# Altium project multiplexer_board.PrjPcb
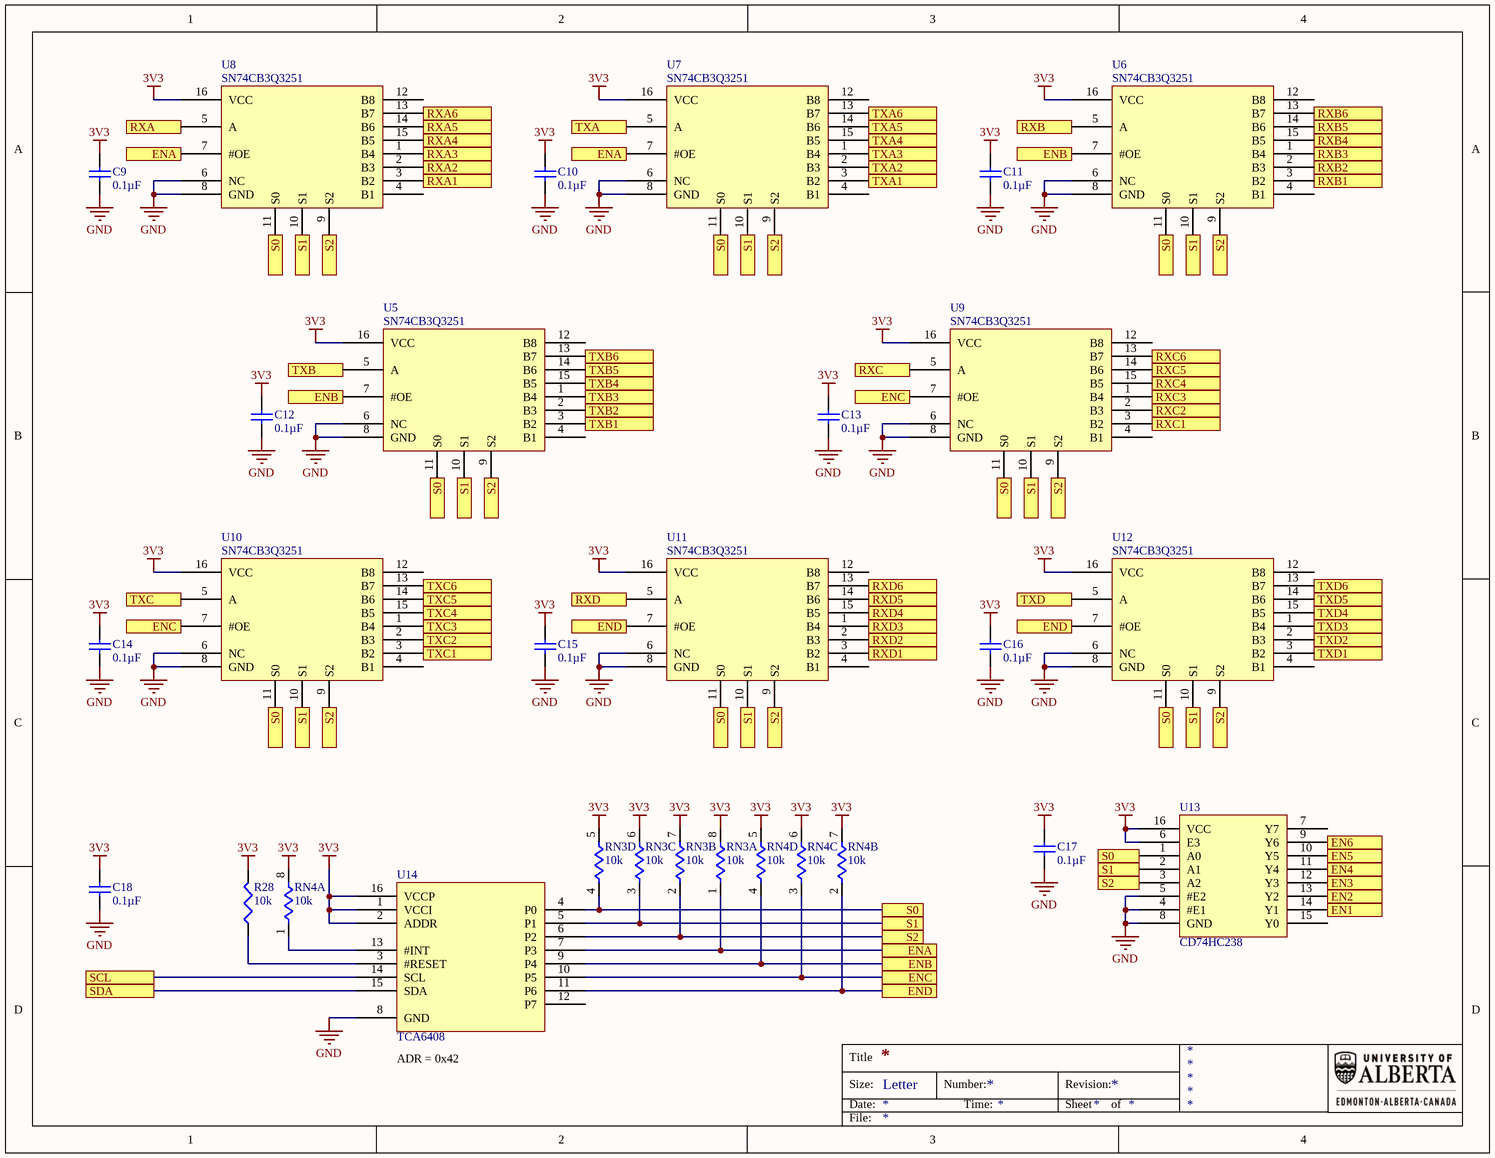
[diagram p0: multiplexers.SchDoc]
5 sheets, 113 parts. Net scope: flat (ports and power ports of the same name join across sheets).
Board file: multiplexer_board.PcbDoc
Sheets:
  multiplexers.SchDoc
  Connectors.SchDoc
  Slip_Ring.SchDoc
  Current_Sensors.SchDoc
  PWM_Controller.SchDoc

## Sheet multiplexers.SchDoc
size Letter

### Parts
C9  value 0.1µF  [TDK-CGA3E]  (hidden comment: Cap)
C10  value 0.1µF  [TDK-CGA3E]  (hidden comment: Cap)
C11  value 0.1µF  [TDK-CGA3E]  (hidden comment: Cap)
C12  value 0.1µF  [TDK-CGA3E]  (hidden comment: Cap)
C13  value 0.1µF  [TDK-CGA3E]  (hidden comment: Cap)
C14  value 0.1µF  [TDK-CGA3E]  (hidden comment: Cap)
C15  value 0.1µF  [TDK-CGA3E]  (hidden comment: Cap)
C16  value 0.1µF  [TDK-CGA3E]  (hidden comment: Cap)
C17  value 0.1µF  [TDK-CGA3E]  (hidden comment: Cap)
C18  value 0.1µF  [TDK-CGA3E]  (hidden comment: Cap)
R28  value 10k  [PANA-ERJ3EK]  (hidden comment: Res3)
RN3  value 10k  [PANA-EXB1206]  (hidden comment: Res4 Pack1)  (parts A,B,C,D of 4)
RN4  value 10k  [PANA-EXB1206]  (hidden comment: Res4 Pack1)  (parts A,B,C,D of 4)
U5  SN74CB3Q3251  [TI-PW]
U6  SN74CB3Q3251  [TI-PW]
U7  SN74CB3Q3251  [TI-PW]
U8  SN74CB3Q3251  [TI-PW]
U9  SN74CB3Q3251  [TI-PW]
U10  SN74CB3Q3251  [TI-PW]
U11  SN74CB3Q3251  [TI-PW]
U12  SN74CB3Q3251  [TI-PW]
U13  CD74HC238  [TI-PW]
U14  TCA6408  [TI-PW]

### Ports
EN1, EN2, EN3, EN4, EN5, EN6, ENA, ENB, ENC, END, RXA, RXA1, RXA2, RXA3, RXA4, RXA5, RXA6, RXB, RXB1, RXB2, RXB3, RXB4, RXB5, RXB6, RXC, RXC1, RXC2, RXC3, RXC4, RXC5, RXC6, RXD, RXD1, RXD2, RXD3, RXD4, RXD5, RXD6, S0, S1, S2, SCL, SDA, TXA, TXA1, TXA2, TXA3, TXA4, TXA5, TXA6, TXB, TXB1, TXB2, TXB3, TXB4, TXB5, TXB6, TXC, TXC1, TXC2, TXC3, TXC4, TXC5, TXC6, TXD, TXD1, TXD2, TXD3, TXD4, TXD5, TXD6

### Nets
3V3: C9.2 C10.2 C11.2 C12.2 C13.2 C14.2 C15.2 C16.2 C17.2 C18.2 R28.2 RN3.5 RN3.6 RN3.7 RN3.8 RN4.5 RN4.6 RN4.7 RN4.8 U5.16(VCC) U6.16(VCC) U7.16(VCC) U8.16(VCC) U9.16(VCC) U10.16(VCC) U11.16(VCC) U12.16(VCC) U13.6(E3) U13.16(VCC) U14.1(VCCI) U14.2(ADDR) U14.16(VCCP)
GND: C9.1 C10.1 C11.1 C12.1 C13.1 C14.1 C15.1 C16.1 C17.1 C18.1 U5.6(NC) U5.8(GND) U6.6(NC) U6.8(GND) U7.6(NC) U7.8(GND) U8.6(NC) U8.8(GND) U9.6(NC) U9.8(GND) U10.6(NC) U10.8(GND) U11.6(NC) U11.8(GND) U12.6(NC) U12.8(GND) U13.4(#E1) U13.5(#E2) U13.8(GND) U14.8(GND)
NetP1_1: U8.3(B2) ; port RXA1
NetP1_2: U7.3(B2) ; port TXA1
NetP1_5: U6.3(B2) ; port RXB1
NetP1_6: U5.3(B2) ; port TXB1
NetP1_15: U10.3(B2) ; port TXC1
NetP1_16: U9.3(B2) ; port RXC1
NetP1_19: U12.3(B2) ; port TXD1
NetP1_20: U11.3(B2) ; port RXD1
NetP2_1: U8.15(B5) ; port RXA4
NetP2_2: U7.15(B5) ; port TXA4
NetP2_5: U6.15(B5) ; port RXB4
NetP2_6: U5.15(B5) ; port TXB4
NetP2_15: U10.15(B5) ; port TXC4
NetP2_16: U9.15(B5) ; port RXC4
NetP2_19: U12.15(B5) ; port TXD4
NetP2_20: U11.15(B5) ; port RXD4
NetP3_1: U8.2(B3) ; port RXA2
NetP3_2: U7.2(B3) ; port TXA2
NetP3_5: U6.2(B3) ; port RXB2
NetP3_6: U5.2(B3) ; port TXB2
NetP3_15: U10.2(B3) ; port TXC2
NetP3_16: U9.2(B3) ; port RXC2
NetP3_19: U12.2(B3) ; port TXD2
NetP3_20: U11.2(B3) ; port RXD2
NetP4_1: U8.14(B6) ; port RXA5
NetP4_2: U7.14(B6) ; port TXA5
NetP4_5: U6.14(B6) ; port RXB5
NetP4_6: U5.14(B6) ; port TXB5
NetP4_15: U10.14(B6) ; port TXC5
NetP4_16: U9.14(B6) ; port RXC5
NetP4_19: U12.14(B6) ; port TXD5
NetP4_20: U11.14(B6) ; port RXD5
NetP5_1: U8.1(B4) ; port RXA3
NetP5_2: U7.1(B4) ; port TXA3
NetP5_5: U6.1(B4) ; port RXB3
NetP5_6: U5.1(B4) ; port TXB3
NetP5_15: U10.1(B4) ; port TXC3
NetP5_16: U9.1(B4) ; port RXC3
NetP5_19: U12.1(B4) ; port TXD3
NetP5_20: U11.1(B4) ; port RXD3
NetP6_1: U8.13(B7) ; port RXA6
NetP6_2: U7.13(B7) ; port TXA6
NetP6_5: U6.13(B7) ; port RXB6
NetP6_6: U5.13(B7) ; port TXB6
NetP6_15: U10.13(B7) ; port TXC6
NetP6_16: U9.13(B7) ; port RXC6
NetP6_19: U12.13(B7) ; port TXD6
NetP6_20: U11.13(B7) ; port RXD6
NetP7_1: U8.5(A) ; port RXA
NetP7_2: U7.5(A) ; port TXA
NetP7_3: U6.5(A) ; port RXB
NetP7_4: U5.5(A) ; port TXB
NetP8_1: U9.5(A) ; port RXC
NetP8_2: U10.5(A) ; port TXC
NetP8_3: U11.5(A) ; port RXD
NetP8_4: U12.5(A) ; port TXD
NetP9_3: U14.14(SCL) ; port SCL
NetP9_4: U14.15(SDA) ; port SDA
NetQ1_2: U13.14(Y1) ; port EN1
NetQ2_2: U13.11(Y4) ; port EN4
NetQ3_2: U13.13(Y2) ; port EN2
NetQ4_2: RN3.1 U7.7(#OE) U8.7(#OE) U14.7(P3) ; port ENA
NetQ5_2: RN4.4 U5.7(#OE) U6.7(#OE) U14.9(P4) ; port ENB
NetQ6_2: RN4.3 U9.7(#OE) U10.7(#OE) U14.10(P5) ; port ENC
NetQ7_2: RN4.2 U11.7(#OE) U12.7(#OE) U14.11(P6) ; port END
NetQ8_2: U13.10(Y5) ; port EN5
NetQ9_2: U13.12(Y3) ; port EN3
NetQ10_2: U13.9(Y6) ; port EN6
NetR28_1: R28.1 U14.3(#RESET)
NetRN3_2: RN3.2 U5.9(S2) U6.9(S2) U7.9(S2) U8.9(S2) U9.9(S2) U10.9(S2) U11.9(S2) U12.9(S2) U13.3(A2) U14.6(P2) ; port S2
NetRN3_3: RN3.3 U5.10(S1) U6.10(S1) U7.10(S1) U8.10(S1) U9.10(S1) U10.10(S1) U11.10(S1) U12.10(S1) U13.2(A1) U14.5(P1) ; port S1
NetRN3_4: RN3.4 U5.11(S0) U6.11(S0) U7.11(S0) U8.11(S0) U9.11(S0) U10.11(S0) U11.11(S0) U12.11(S0) U13.1(A0) U14.4(P0) ; port S0
NetRN4_1: RN4.1 U14.13(#INT)

Not connected (* = marked no-connect by the designer): U5 4(B1) 12(B8); U6 4(B1) 12(B8); U7 4(B1) 12(B8); U8 4(B1) 12(B8); U9 4(B1) 12(B8); U10 4(B1) 12(B8); U11 4(B1) 12(B8); U12 4(B1) 12(B8); U13 7(Y7) 15(Y0); U14 12(P7)

### Notes on the sheet
- (near U14) ADR = 0x42
- Title
- Size:
- Date:
- Letter
- Number:
- Time:
- Revision:
- Sheet
- of
- File:

### Library data of the parts
C9-C18 = PC-TDK-02273: CAP CER 0.1UF 50V X8R 0603; Manufacturer Part Number: CGA3E3X8R1H104M080AB; Index: 2273; Designator: C?; Tolerance: ±20%; Published: 3/16/2016; LatestRevisionDate: 3/16/2016; LatestRevisionNote: ...; PackageReference: 0603 (1608 Metric); Publisher: AlbertaSat; PackageDescription: Radial Cap, Thru-Hole; 2 Leads; 0.3 in Pin Spacing; Part Number: PC-TDK-02273; Supplier Part Number 1: 445-12607-1-ND; Supplier 1: Digi-key; Supplier Link: http://www.digikey.ca/product-search/en?keywords=445-12607-1-ND; Voltage - Rated: 50V; Temperature Coefficient: X8R; Applications: Automotive
R28 = 17203: RES SMD 10K OHM 1% 1/10W 0603; Part Number: 17203; Manufacturer Part Number: ERJ-3EKF1002V; Designator: R?; Power: 0.1W, 1/10W; Temperature Coefficient: ±100ppm/°C; Published: 8-Jun-2000; LatestRevisionDate: 29-May-2009; LatestRevisionNote: IPC-7351 Footprint Added.; PackageReference: 0603 (1608 Metric); Publisher: Altium Limited; PackageDescription: Chip Resistor, 2-Leads, Body 1.60x0.80mm, IPC Low Density; Supplier Part Number 1: P10.0KHCT-ND; Supplier 1: Digi-Key; Supplier Link: http://www.digikey.ca/product-search/en?keywords=P10.0KHCT-ND; Tolerance: ±1%
RN3 RN4 = 19842: RES ARRAY 4 RES 10K OHM 1206; Part Number: 19842; Manufacturer Part Number: EXB-38V103JV; Sim Note: Enter the Resistance value into parameter field.; Designator: RN?; Tolerance: ±5%; Power: 62.5mW; Temperature Coefficient: ±200ppm/°C; Code_JEDEC: MS-012-AC; Supplier Part Number 1: Y9103CT-ND; Supplier 1: Digi-Key; Supplier Link: http://www.digikey.ca/product-search/en?keywords=Y9103CT-ND; PackageReference: 1206 (3216 Metric), Convex, Long Side Terminals; PackageDescription: Chip Array, ConvexS, 8-Leads, Pitch 0.80mm,  Body 3.20x1.60mm,  IPC Low Density
U5-U12 = 42: IC HI-BAND MUX/DEMUX 16-TSSOP; Part Number: 42; Manufacturer Part Number: SN74CB3Q3251PWR; Designator: U?; Supplier Part Number 2: 595-SN74CB3Q3251PWR; Supplier 2: Mouser; Supplier Part Number 1: 296-18204-1-ND; Supplier 1: Digi-Key; Supplier Link: #https://www.digikey.ca/product-detail/en/texas-instruments/SN74CB3Q3251PWR/296-18204-1-ND/773829#; PackageReference: TI-TSSOP16
U13 = 45: IC DECODER/DEMUX HS 3-8 16TSSOP; Part Number: 45; Manufacturer Part Number: CD74HC238PW; Designator: U?; Supplier Part Number 2: 595-CD74HC238PWR; Supplier 2: Mouser; Supplier Part Number 1: 296-33050-5-ND; Supplier 1: Digi-Key; Supplier Link: #https://www.digikey.ca/product-detail/en/texas-instruments/CD74HC238PW/296-33050-5-ND/1506874#; PackageReference: TI-16TSSOP
U14 = 46: IC I/O EXPANDER I2C 8B 16TSSOP; Part Number: 46; Manufacturer Part Number: TCA6408AQPWRQ1; Designator: U?; Supplier Part Number 2: 595-TCA6408AQPWRQ1; Supplier 2: Mouser; Supplier Part Number 1: 296-44902-1-ND; Supplier 1: Digi-Key; Supplier Link: #https://www.digikey.com/products/en/integrated-circuits-ics/interface-i-o-expanders/749?k=&pkeyword=&s=39106&FV=1c0002%2C1c0006%2C4032eb%2C403305%2C40346d%2C4035f0%2C1140003%2C26800c4%2C2680042%2C2680043%2C274001d%2C2740253%2C1f140000%2Cffe002ed%2Cfffc0128&quantity=0&ColumnSort=0&page=1&stock=1&pageSize=250#; PackageReference: TI-16TSSOP

## Sheet Connectors.SchDoc
size Letter
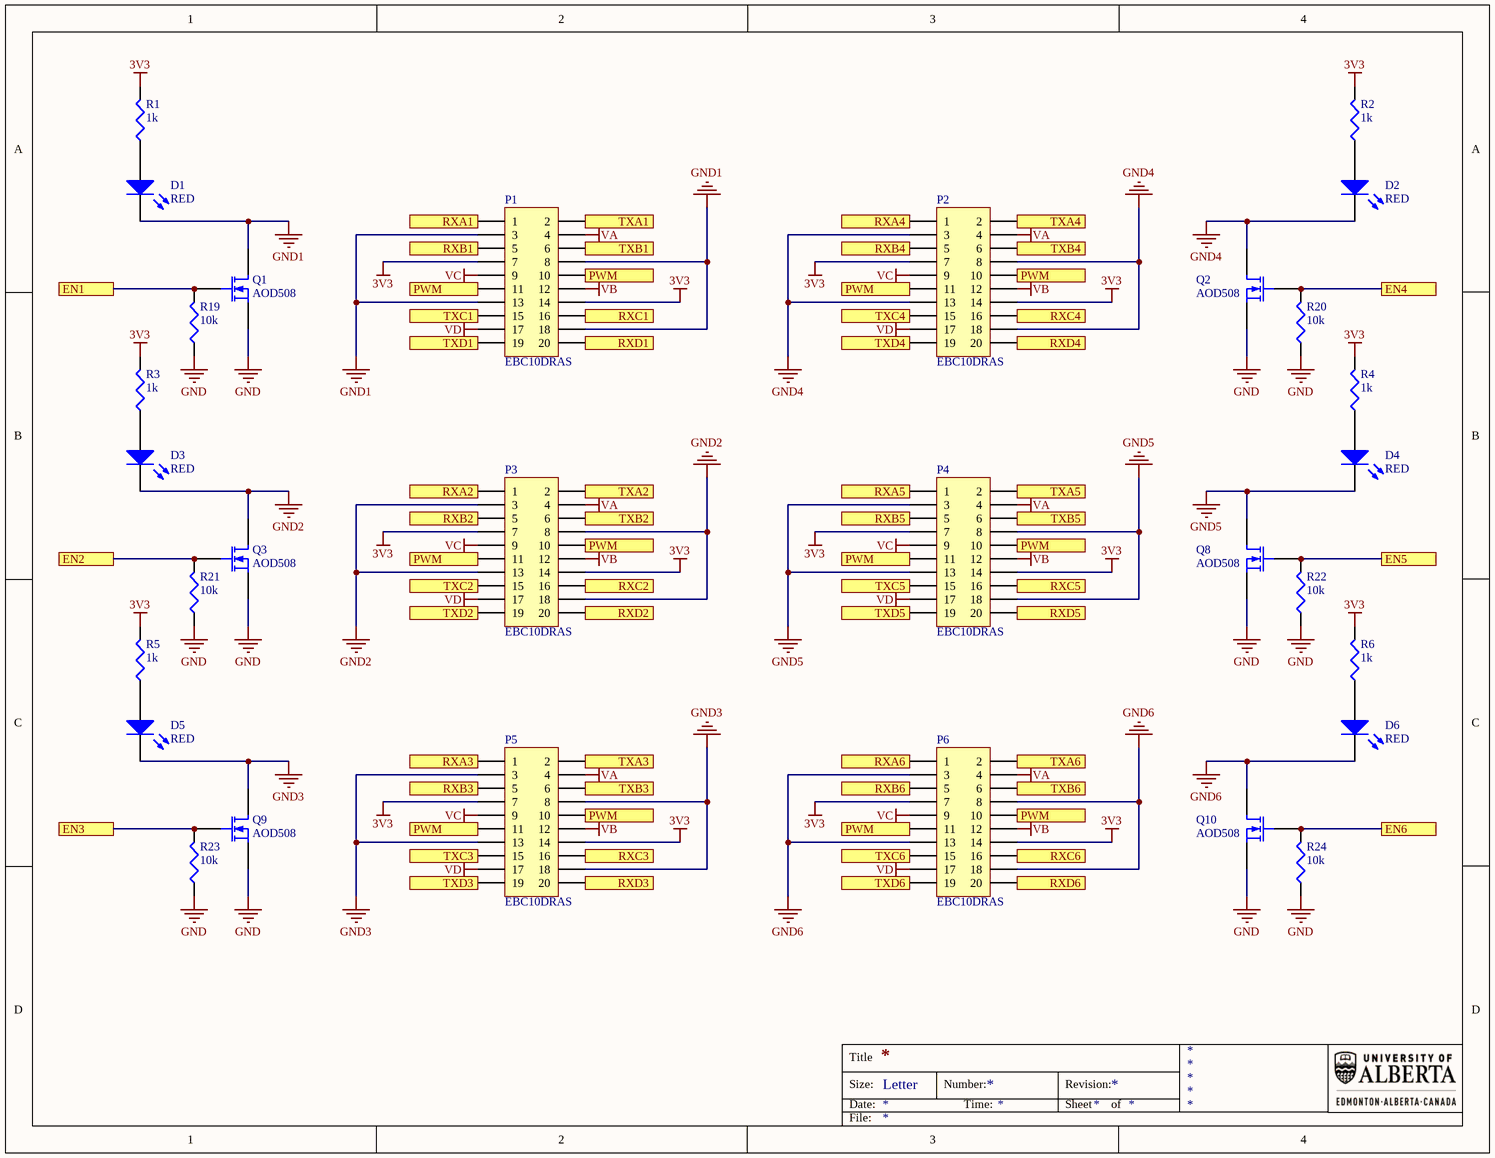
[diagram p1: Connectors.SchDoc]

### Parts
D1  value RED  [WL-150060XS75000]  (hidden comment: LED)
D2  value RED  [WL-150060XS75000]  (hidden comment: LED)
D3  value RED  [WL-150060XS75000]  (hidden comment: LED)
D4  value RED  [WL-150060XS75000]  (hidden comment: LED)
D5  value RED  [WL-150060XS75000]  (hidden comment: LED)
D6  value RED  [WL-150060XS75000]  (hidden comment: LED)
P1  Manufacturer Part Number: EBC10DRAS  [SLN-EBC10DRAS]  (hidden comment: Header 10x2)
P2  Manufacturer Part Number: EBC10DRAS  [SLN-EBC10DRAS]  (hidden comment: Header 10x2)
P3  Manufacturer Part Number: EBC10DRAS  [SLN-EBC10DRAS]  (hidden comment: Header 10x2)
P4  Manufacturer Part Number: EBC10DRAS  [SLN-EBC10DRAS]  (hidden comment: Header 10x2)
P5  Manufacturer Part Number: EBC10DRAS  [SLN-EBC10DRAS]  (hidden comment: Header 10x2)
P6  Manufacturer Part Number: EBC10DRAS  [SLN-EBC10DRAS]  (hidden comment: Header 10x2)
Q1  AOD508  [AO-TO252]
Q2  AOD508  [AO-TO252]
Q3  AOD508  [AO-TO252]
Q8  AOD508  [AO-TO252]
Q9  AOD508  [AO-TO252]
Q10  AOD508  [AO-TO252]
R1  value 1k  [PANA-ERJ3EK]  (hidden comment: Res3)
R2  value 1k  [PANA-ERJ3EK]  (hidden comment: Res3)
R3  value 1k  [PANA-ERJ3EK]  (hidden comment: Res3)
R4  value 1k  [PANA-ERJ3EK]  (hidden comment: Res3)
R5  value 1k  [PANA-ERJ3EK]  (hidden comment: Res3)
R6  value 1k  [PANA-ERJ3EK]  (hidden comment: Res3)
R19  value 10k  [PANA-ERJ3EK]  (hidden comment: Res3)
R20  value 10k  [PANA-ERJ3EK]  (hidden comment: Res3)
R21  value 10k  [PANA-ERJ3EK]  (hidden comment: Res3)
R22  value 10k  [PANA-ERJ3EK]  (hidden comment: Res3)
R23  value 10k  [PANA-ERJ3EK]  (hidden comment: Res3)
R24  value 10k  [PANA-ERJ3EK]  (hidden comment: Res3)

### Ports
EN1, EN2, EN3, EN4, EN5, EN6, PWM, RXA1, RXA2, RXA3, RXA4, RXA5, RXA6, RXB1, RXB2, RXB3, RXB4, RXB5, RXB6, RXC1, RXC2, RXC3, RXC4, RXC5, RXC6, RXD1, RXD2, RXD3, RXD4, RXD5, RXD6, TXA1, TXA2, TXA3, TXA4, TXA5, TXA6, TXB1, TXB2, TXB3, TXB4, TXB5, TXB6, TXC1, TXC2, TXC3, TXC4, TXC5, TXC6, TXD1, TXD2, TXD3, TXD4, TXD5, TXD6

### Nets
3V3: P1.7 P1.14 P2.7 P2.14 P3.7 P3.14 P4.7 P4.14 P5.7 P5.14 P6.7 P6.14 R1.2 R2.2 R3.2 R4.2 R5.2 R6.2
GND: Q1.3(S) Q2.3(S) Q3.3(S) Q8.3(S) Q9.3(S) Q10.3(S) R19.1 R20.1 R21.1 R22.1 R23.1 R24.1
GND1: D1.2(K) P1.3 P1.8 P1.13 P1.18 Q1.1(D)
GND2: D3.2(K) P3.3 P3.8 P3.13 P3.18 Q3.1(D)
GND3: D5.2(K) P5.3 P5.8 P5.13 P5.18 Q9.1(D)
GND4: D2.2(K) P2.3 P2.8 P2.13 P2.18 Q2.1(D)
GND5: D4.2(K) P4.3 P4.8 P4.13 P4.18 Q8.1(D)
GND6: D6.2(K) P6.3 P6.8 P6.13 P6.18 Q10.1(D)
VA: P1.4 P2.4 P3.4 P4.4 P5.4 P6.4
VB: P1.12 P2.12 P3.12 P4.12 P5.12 P6.12
VC: P1.9 P2.9 P3.9 P4.9 P5.9 P6.9
VD: P1.17 P2.17 P3.17 P4.17 P5.17 P6.17
NetD1_1: D1.1(A) R1.1
NetD2_1: D2.1(A) R2.1
NetD3_1: D3.1(A) R3.1
NetD4_1: D4.1(A) R4.1
NetD5_1: D5.1(A) R5.1
NetD6_1: D6.1(A) R6.1
NetP1_1: P1.1 ; port RXA1
NetP1_2: P1.2 ; port TXA1
NetP1_5: P1.5 ; port RXB1
NetP1_6: P1.6 ; port TXB1
NetP1_10: P1.10 P1.11 P2.10 P2.11 P3.10 P3.11 P4.10 P4.11 P5.10 P5.11 P6.10 P6.11 ; port PWM
NetP1_15: P1.15 ; port TXC1
NetP1_16: P1.16 ; port RXC1
NetP1_19: P1.19 ; port TXD1
NetP1_20: P1.20 ; port RXD1
NetP2_1: P2.1 ; port RXA4
NetP2_2: P2.2 ; port TXA4
NetP2_5: P2.5 ; port RXB4
NetP2_6: P2.6 ; port TXB4
NetP2_15: P2.15 ; port TXC4
NetP2_16: P2.16 ; port RXC4
NetP2_19: P2.19 ; port TXD4
NetP2_20: P2.20 ; port RXD4
NetP3_1: P3.1 ; port RXA2
NetP3_2: P3.2 ; port TXA2
NetP3_5: P3.5 ; port RXB2
NetP3_6: P3.6 ; port TXB2
NetP3_15: P3.15 ; port TXC2
NetP3_16: P3.16 ; port RXC2
NetP3_19: P3.19 ; port TXD2
NetP3_20: P3.20 ; port RXD2
NetP4_1: P4.1 ; port RXA5
NetP4_2: P4.2 ; port TXA5
NetP4_5: P4.5 ; port RXB5
NetP4_6: P4.6 ; port TXB5
NetP4_15: P4.15 ; port TXC5
NetP4_16: P4.16 ; port RXC5
NetP4_19: P4.19 ; port TXD5
NetP4_20: P4.20 ; port RXD5
NetP5_1: P5.1 ; port RXA3
NetP5_2: P5.2 ; port TXA3
NetP5_5: P5.5 ; port RXB3
NetP5_6: P5.6 ; port TXB3
NetP5_15: P5.15 ; port TXC3
NetP5_16: P5.16 ; port RXC3
NetP5_19: P5.19 ; port TXD3
NetP5_20: P5.20 ; port RXD3
NetP6_1: P6.1 ; port RXA6
NetP6_2: P6.2 ; port TXA6
NetP6_5: P6.5 ; port RXB6
NetP6_6: P6.6 ; port TXB6
NetP6_15: P6.15 ; port TXC6
NetP6_16: P6.16 ; port RXC6
NetP6_19: P6.19 ; port TXD6
NetP6_20: P6.20 ; port RXD6
NetQ1_2: Q1.2(G) R19.2 ; port EN1
NetQ2_2: Q2.2(G) R20.2 ; port EN4
NetQ3_2: Q3.2(G) R21.2 ; port EN2
NetQ8_2: Q8.2(G) R22.2 ; port EN5
NetQ9_2: Q9.2(G) R23.2 ; port EN3
NetQ10_2: Q10.2(G) R24.2 ; port EN6

### Notes on the sheet
- Title
- Size:
- Date:
- Letter
- Number:
- Time:
- Revision:
- Sheet
- of
- File:

### Library data of the parts
D1-D6 = 3: LED RED CLEAR 0603 SMD; Part Number: 3; Manufacturer Part Number: 150060RS75000; Designator: D?; Brightness: 250mcd; Published: 8-Jun-2000; LatestRevisionDate: 08-Jul-2005; LatestRevisionNote: Mech Layer 1 removed.; PackageReference: WL-150060XS75000; Publisher: Altium Limited; PackageDescription: LED; 2 Leads; Supplier Part Number 1: 732-4978-1-ND; Supplier 1: Digi-Key; Supplier Link: http://www.digikey.ca/product-search/en?keywords=732-4978-1-ND
P1-P6 = PP-SLN-00105: CONN EDGE DUAL FMALE 20POS 0.100; Index: 105; Designator: P?; Number of Positions: 20; Pitch: 0.100" (2.54mm); LatestRevisionDate: 3/22/2018; LatestRevisionNote: ...; Publisher: AlbertaSat; Part Number: PP-SLN-00105; Supplier Part Number 1: S3300-ND; Supplier 1: Digi-key; Published: 3/22/2018; PackageReference: SLN-EBC10DRAS; PackageDescription: CONN EDGE DUAL FMALE 20POS 0.100; Supplier Link: #https://www.digikey.ca/product-detail/en/sullins-connector-solutions/EBC10DRAS/S3300-ND/927252#; Number of Rows: 2; Mounting Type: Through Hole
Q1-Q3 Q8-Q10 = 1: MOSFET N-CH 30V 22A TO252; Part Number: 1; Designator: Q?; Published: 8-Jun-2000; LatestRevisionDate: 17-Jul-2002; LatestRevisionNote: Re-released for DXP Platform.; PackageVersion: 1995/1996; PackageReference: AO-TO252; Publisher: Altium Limited; PackageDescription: TO, Flat Index; 3 In-Line, Axial Leads; Body Dia. 4.6mm; Lead Dia. 0.5 mm (max); Manufacturer Part Number: AOD508; Supplier Part Number 1: 785-1355-1-ND; Supplier 1: Digi-Key; Supplier Link: #http://www.digikey.ca/product-search/en?keywords=785-1355-1-ND#
R1-R6 = 15398: RES SMD 1K OHM 1% 1/10W 0603; Part Number: 15398; Manufacturer Part Number: ERJ-3EKF1001V; Designator: R?; Power: 0.1W, 1/10W; Temperature Coefficient: ±100ppm/°C; Published: 8-Jun-2000; LatestRevisionDate: 29-May-2009; LatestRevisionNote: IPC-7351 Footprint Added.; PackageReference: 0603 (1608 Metric); Publisher: Altium Limited; PackageDescription: Chip Resistor, 2-Leads, Body 1.60x0.80mm, IPC Low Density; Supplier Part Number 1: P1.00KHCT-ND; Supplier 1: Digi-Key; Supplier Link: http://www.digikey.ca/product-search/en?keywords=P1.00KHCT-ND; Tolerance: ±1%
R19-R24 = 17203: as R28 on sheet multiplexers; Published: 8-Jun-2000; LatestRevisionDate: 29-May-2009; LatestRevisionNote: IPC-7351 Footprint Added.; PackageReference: 0603 (1608 Metric); Publisher: Altium Limited; PackageDescription: Chip Resistor, 2-Leads, Body 1.60x0.80mm, IPC Low Density; Supplier Part Number 1: P10.0KHCT-ND; Supplier 1: Digi-Key; Supplier Link: http://www.digikey.ca/product-search/en?keywords=P10.0KHCT-ND; Tolerance: ±1%

## Sheet Slip_Ring.SchDoc
size Letter
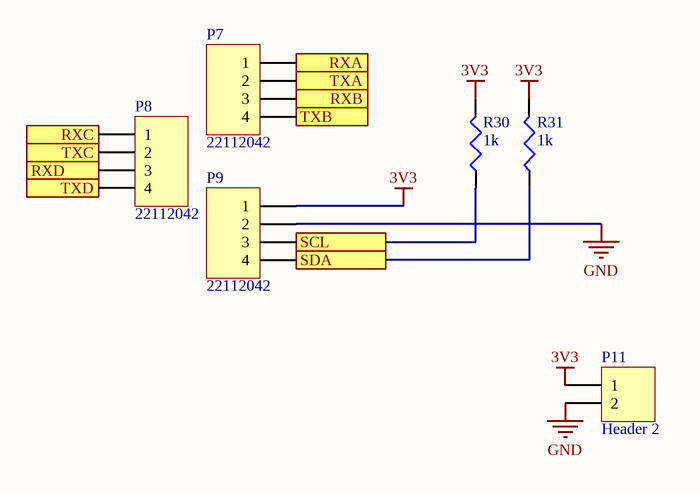
[diagram p2: Slip_Ring.SchDoc]

### Parts
P7  Manufacturer Part Number: 22112042  [MOLX-22112042]  (hidden comment: Header 4)
P8  Manufacturer Part Number: 22112042  [MOLX-22112042]  (hidden comment: Header 4)
P9  Manufacturer Part Number: 22112042  [MOLX-22112042]  (hidden comment: Header 4)
P11  Header 2  [MOLX-0010845020]
R30  value 1k  [PANA-ERJ3EK]  (hidden comment: Res3)
R31  value 1k  [PANA-ERJ3EK]  (hidden comment: Res3)

### Ports
RXA, RXB, RXC, RXD, SCL, SDA, TXA, TXB, TXC, TXD

### Nets
3V3: P9.1 P11.1 R30.2 R31.2
GND: P9.2 P11.2
NetP7_1: P7.1 ; port RXA
NetP7_2: P7.2 ; port TXA
NetP7_3: P7.3 ; port RXB
NetP7_4: P7.4 ; port TXB
NetP8_1: P8.1 ; port RXC
NetP8_2: P8.2 ; port TXC
NetP8_3: P8.3 ; port RXD
NetP8_4: P8.4 ; port TXD
NetP9_3: P9.3 R30.1 ; port SCL
NetP9_4: P9.4 R31.1 ; port SDA

### Notes on the sheet
- Title
- Size:
- Date:
- Letter
- Number:
- Time:
- Revision:
- Sheet
- of
- File:

### Library data of the parts
P7-P9 = 34: CONN HEADER 4POS .100 VERT GOLD; Part Number: 34; Designator: P?; LatestRevisionDate: 17-Jul-2002; LatestRevisionNote: Re-released for DXP Platform.; Publisher: Altium Limited; Supplier Part Number 1: WM2702-ND; Supplier 1: Digi-Key; Supplier Link: http://www.digikey.ca/product-search/en?keywords=WM2702-ND; PackageReference: MOLX-22112042
P11 = 41: CONN HEADER PIN 94V-0 2POS; Part Number: 41; Manufacturer Part Number: 0010845020; Designator: P?; LatestRevisionDate: 17-Jul-2002; LatestRevisionNote: Re-released for DXP Platform.; Publisher: Altium Limited; Supplier Part Number 1: WM13100-ND; Supplier 1: Digi-Key; Supplier Link: #https://www.digikey.com/product-detail/en/molex-llc/0010845020/WM13100-ND/3068040#; PackageReference: MOLX-0010845020
R30 R31 = 15398: as R1 on sheet Connectors; Published: 8-Jun-2000; LatestRevisionDate: 29-May-2009; LatestRevisionNote: IPC-7351 Footprint Added.; PackageReference: 0603 (1608 Metric); Publisher: Altium Limited; PackageDescription: Chip Resistor, 2-Leads, Body 1.60x0.80mm, IPC Low Density; Supplier Part Number 1: P1.00KHCT-ND; Supplier 1: Digi-Key; Supplier Link: http://www.digikey.ca/product-search/en?keywords=P1.00KHCT-ND; Tolerance: ±1%

## Sheet Current_Sensors.SchDoc
size Letter
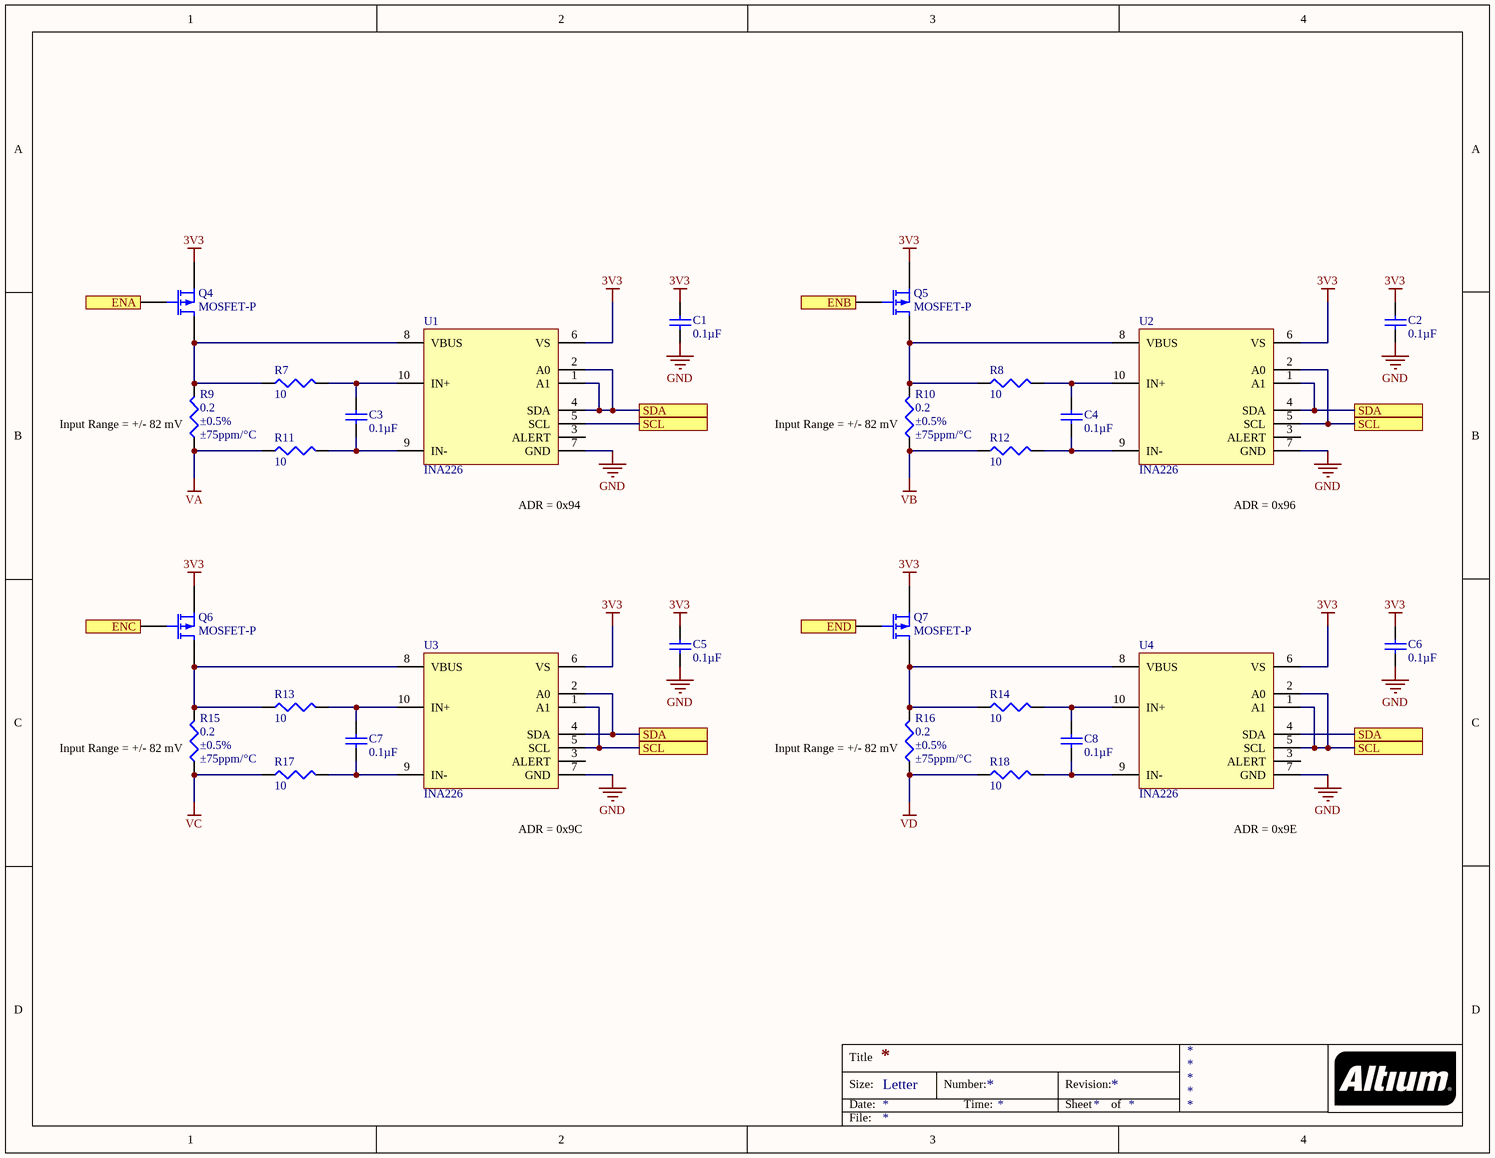
[diagram p3: Current_Sensors.SchDoc]

### Parts
C1  value 0.1µF  [TDK-CGA3E]  (hidden comment: Cap)
C2  value 0.1µF  [TDK-CGA3E]  (hidden comment: Cap)
C3  value 0.1µF  [TDK-CGA3E]  (hidden comment: Cap)
C4  value 0.1µF  [TDK-CGA3E]  (hidden comment: Cap)
C5  value 0.1µF  [TDK-CGA3E]  (hidden comment: Cap)
C6  value 0.1µF  [TDK-CGA3E]  (hidden comment: Cap)
C7  value 0.1µF  [TDK-CGA3E]  (hidden comment: Cap)
C8  value 0.1µF  [TDK-CGA3E]  (hidden comment: Cap)
Q4  MOSFET-P  [VSH-SO-8L]
Q5  MOSFET-P  [VSH-SO-8L]
Q6  MOSFET-P  [VSH-SO-8L]
Q7  MOSFET-P  [VSH-SO-8L]
R7  value 10  [PANA-ERA2A]  (hidden comment: Res3)
R8  value 10  [PANA-ERA2A]  (hidden comment: Res3)
R9  value 0.2  Tolerance: ±0.5%  Temperature Coefficient: ±75ppm/°C  [VSH-WSL2512]  (hidden comment: Res3)
R10  value 0.2  Tolerance: ±0.5%  Temperature Coefficient: ±75ppm/°C  [VSH-WSL2512]  (hidden comment: Res3)
R11  value 10  [PANA-ERA2A]  (hidden comment: Res3)
R12  value 10  [PANA-ERA2A]  (hidden comment: Res3)
R13  value 10  [PANA-ERA2A]  (hidden comment: Res3)
R14  value 10  [PANA-ERA2A]  (hidden comment: Res3)
R15  value 0.2  Tolerance: ±0.5%  Temperature Coefficient: ±75ppm/°C  [VSH-WSL2512]  (hidden comment: Res3)
R16  value 0.2  Tolerance: ±0.5%  Temperature Coefficient: ±75ppm/°C  [VSH-WSL2512]  (hidden comment: Res3)
R17  value 10  [PANA-ERA2A]  (hidden comment: Res3)
R18  value 10  [PANA-ERA2A]  (hidden comment: Res3)
U1  INA226  [TI-DGS]
U2  INA226  [TI-DGS]
U3  INA226  [TI-DGS]
U4  INA226  [TI-DGS]

### Ports
ENA, ENB, ENC, END, SCL, SDA

### Nets
3V3: C1.2 C2.2 C5.2 C6.2 Q4.3(S) Q5.3(S) Q6.3(S) Q7.3(S) U1.6(VS) U2.6(VS) U3.6(VS) U4.6(VS)
GND: C1.1 C2.1 C5.1 C6.1 U1.7(GND) U2.7(GND) U3.7(GND) U4.7(GND)
VA: R9.1 R11.1
VB: R10.1 R12.1
VC: R15.1 R17.1
VD: R16.1 R18.1
NetC3_1: C3.1 R11.2 U1.9(IN-)
NetC3_2: C3.2 R7.2 U1.10(IN+)
NetC4_1: C4.1 R12.2 U2.9(IN-)
NetC4_2: C4.2 R8.2 U2.10(IN+)
NetC7_1: C7.1 R17.2 U3.9(IN-)
NetC7_2: C7.2 R13.2 U3.10(IN+)
NetC8_1: C8.1 R18.2 U4.9(IN-)
NetC8_2: C8.2 R14.2 U4.10(IN+)
NetP9_3: U1.5(SCL) U2.2(A0) U2.5(SCL) U3.1(A1) U3.5(SCL) U4.1(A1) U4.2(A0) U4.5(SCL) ; port SCL
NetP9_4: U1.1(A1) U1.2(A0) U1.4(SDA) U2.1(A1) U2.4(SDA) U3.2(A0) U3.4(SDA) U4.4(SDA) ; port SDA
NetQ4_1: Q4.1(D) R7.1 R9.2 U1.8(VBUS)
NetQ4_2: Q4.2(G) ; port ENA
NetQ5_1: Q5.1(D) R8.1 R10.2 U2.8(VBUS)
NetQ5_2: Q5.2(G) ; port ENB
NetQ6_1: Q6.1(D) R13.1 R15.2 U3.8(VBUS)
NetQ6_2: Q6.2(G) ; port ENC
NetQ7_1: Q7.1(D) R14.1 R16.2 U4.8(VBUS)
NetQ7_2: Q7.2(G) ; port END

Not connected (* = marked no-connect by the designer): U1 3(ALERT); U2 3(ALERT); U3 3(ALERT); U4 3(ALERT)

### Notes on the sheet
- (near R9) Input Range = +/- 82 mV
- (near R10) Input Range = +/- 82 mV
- (near U1) ADR = 0x94
- (near U2) ADR = 0x96
- (near R15) Input Range = +/- 82 mV
- (near R16) Input Range = +/- 82 mV
- (near U3) ADR = 0x9C
- (near U4) ADR = 0x9E
- Title
- Size:
- Date:
- Letter
- Number:
- Time:
- Revision:
- Sheet
- of
- File:

### Library data of the parts
C1 C2 C5 C6 = PC-TDK-02273: as C9 on sheet multiplexers; Published: 3/16/2016; LatestRevisionDate: 3/16/2016; LatestRevisionNote: ...; PackageReference: 0603 (1608 Metric); Publisher: AlbertaSat; PackageDescription: Radial Cap, Thru-Hole; 2 Leads; 0.3 in Pin Spacing; Part Number: PC-TDK-02273; Supplier Part Number 1: 445-12607-1-ND; Supplier 1: Digi-key; Supplier Link: http://www.digikey.ca/product-search/en?keywords=445-12607-1-ND; Voltage - Rated: 50V; Temperature Coefficient: X8R; Applications: Automotive
C3 C4 C7 C8 = PC-TDK-02272: CAP CER 0.1UF 50V X8R 0603; Manufacturer Part Number: CGA3E3X8R1H104K080AB; Index: 2272; Designator: C?; Tolerance: ±10%; Published: 2016-03-16; LatestRevisionDate: 2016-03-16; LatestRevisionNote: ...; PackageReference: 0603 (1608 Metric); Publisher: AlbertaSat; PackageDescription: Radial Cap, Thru-Hole; 2 Leads; 0.3 in Pin Spacing; Part Number: PC-TDK-02272; Supplier Part Number 1: 445-12606-1-ND; Supplier 1: Digi-key; Supplier Link: http://www.digikey.ca/product-search/en?keywords=445-12606-1-ND; Voltage - Rated: 50V; Temperature Coefficient: X8R; Applications: Automotive
Q4-Q7 = PQ-VSH-00264: MOSFET P-CH 12V 60A POWERPAKSO-8; Manufacturer Part Number: SQJ411EP-T1_GE3; Index: 264; Designator: Q?; Published: 2018-03-27; LatestRevisionDate: 2018-03-27; LatestRevisionNote: ...; PackageVersion: 1995/1996; PackageReference: VSH-POWERPAKSO-8; Publisher: AlbertaSat; PackageDescription: SOIC, 8-Leads, Body 4.90x4.37mm, Pitch 1.27mm, Thermal Pad 4.07x3.63mm, IPC Low Density; Part Number: PQ-VSH-00264; Supplier Part Number 1: SQJ411EP-T1_GE3CT-ND; Supplier 1: Digi-key; Supplier Part Number 2: 78-SQJ411EP-T1_GE3; Supplier 2: Mouser; Supplier Link: #https://www.digikey.ca/product-detail/en/vishay-siliconix/SQJ411EP-T1_GE3/SQJ411EP-T1_GE3CT-ND/6709019#; Applications: Automotive
R7 R8 R11-R14 R17 R18 = 13235: RES SMD 10 OHM 0.5% 1/16W 0402; Part Number: 13235; Manufacturer Part Number: ERA-2AKD100X; Designator: R?; Power: 0.063W, 1/16W; Temperature Coefficient: ±100ppm/°C; Published: 8-Jun-2000; LatestRevisionDate: 29-May-2009; LatestRevisionNote: IPC-7351 Footprint Added.; PackageReference: 0402 (1005 Metric); Publisher: Altium Limited; PackageDescription: Chip Resistor, 2-Leads, Body 1.00x0.50mm, IPC Low Density; Supplier Part Number 1: P10DDCT-ND; Supplier 1: Digi-Key; Supplier Link: http://www.digikey.ca/product-search/en?keywords=P10DDCT-ND; Tolerance: ±0.5%
R9 R10 R15 R16 = PR-VSH-00260: Current Sense Resistors - SMD 1watt .2ohms .5% 2512; Manufacturer Part Number: WSL2512R2000DEA; Index: 260; Designator: R?; Power - Rated: 1W; Published: 2017-10-16; LatestRevisionDate: 2017-10-16; LatestRevisionNote: ...; PackageReference: VSH-WSL2512; Publisher: AlbertaSat; PackageDescription: Chip Resistor, 2-Leads, Body 6.35x3.18mm, IPC Low Density; Part Number: PR-VSH-00260; Supplier Part Number 1: 71-WSL2512R2000DEA; Supplier 1: Mouser; Supplier Link: #https://ca.mouser.com/ProductDetail/Vishay-Dale/WSL2512R2000DEA?qs=sGAEpiMZZMtlleCFQhR%2fzZ%252bPyWemVGq4IOcPPigD2d8%3d#; Applications: Automotive
U1-U4 = 19: IC MONITOR PWR/CURR BIDIR 10MSOP; Part Number: 19; Manufacturer Part Number: INA226AQDGSRQ1; Designator: U?; Supplier Part Number 2: 595-INA226AQDGSRQ1; Supplier 2: Mouser; Supplier Part Number 1: 296-42503-1-ND; Supplier 1: Digi-Key; Supplier Link: #https://www.digikey.com/product-detail/en/texas-instruments/INA226AQDGSRQ1/296-42503-1-ND/5416001#; PackageReference: TI-MSOP10

## Sheet PWM_Controller.SchDoc
size A4
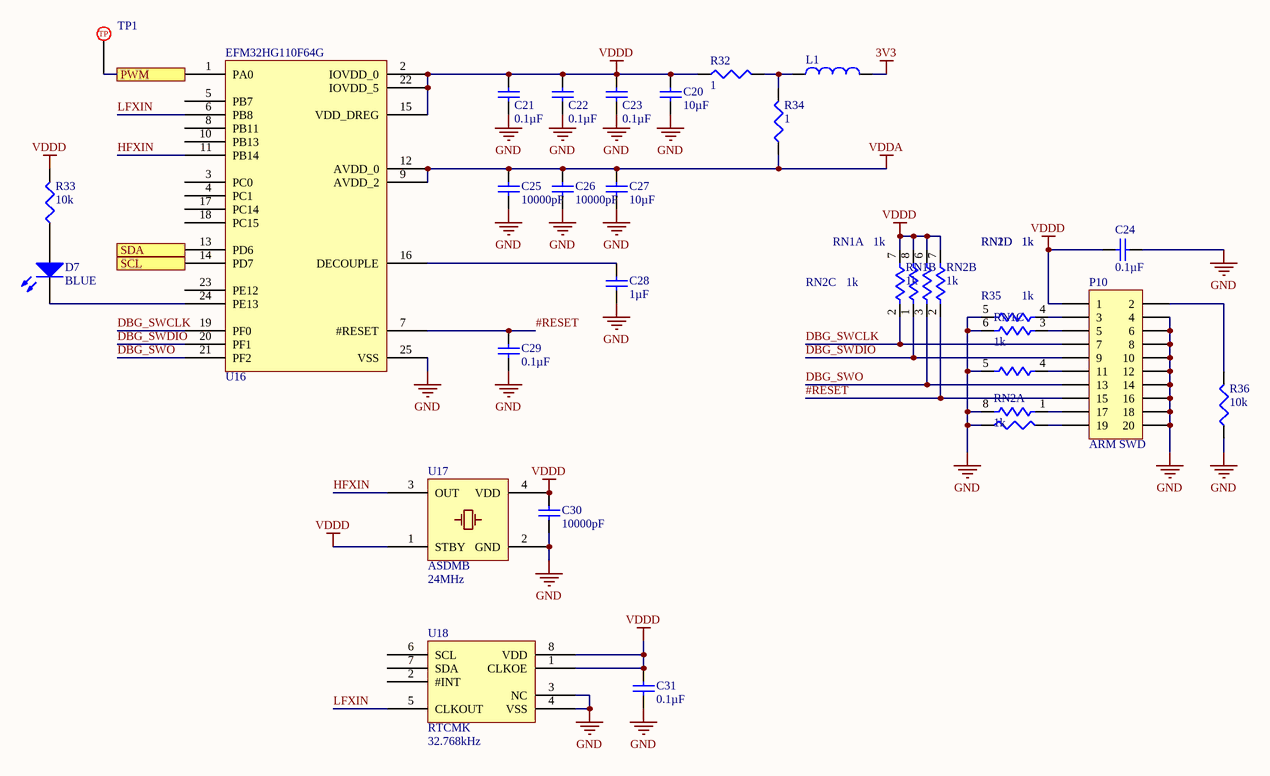
[diagram p4: PWM_Controller.SchDoc]

### Parts
C20  value 10µF  [TDK-CGA5L]  (hidden comment: Cap)
C21  value 0.1µF  [TDK-CGA3E]  (hidden comment: Cap)
C22  value 0.1µF  [TDK-CGA3E]  (hidden comment: Cap)
C23  value 0.1µF  [TDK-CGA3E]  (hidden comment: Cap)
C24  value 0.1µF  [TDK-CGA3E]  (hidden comment: Cap)
C25  value 10000pF  [TDK-CGA3E]  (hidden comment: Cap)
C26  value 10000pF  [TDK-CGA3E]  (hidden comment: Cap)
C27  value 10µF  [TDK-CGA5L]  (hidden comment: Cap)
C28  value 1µF  [TDK-CGA3E]  (hidden comment: Cap)
C29  value 0.1µF  [TDK-CGA3E]  (hidden comment: Cap)
C30  value 10000pF  [TDK-CGA3E]  (hidden comment: Cap)
C31  value 0.1µF  [TDK-CGA3E]  (hidden comment: Cap)
D7  value BLUE  [WL-150060XS75000]  (hidden comment: LED)
L1  Inductor  [TDK-MPX1608]  (value not drawn)
P10  Header 10x2  [SLN-GRPB102]  (value not drawn)
R32  value 1  [VSH-0603MCT]  (hidden comment: Res3)
R33  value 10k  [PANA-ERJ3EK]  (hidden comment: Res3)
R34  value 1  [VSH-0603MCT]  (hidden comment: Res3)
R35  value 1k  [PANA-ERJ3EK]  (hidden comment: Res3)
R36  value 10k  [PANA-ERJ3EK]  (hidden comment: Res3)
RN1  value 1k  [PANA-EXB1206]  (hidden comment: Res4 Pack1)  (parts A,B,C,D of 4)
RN2  value 1k  [PANA-EXB1206]  (hidden comment: Res4 Pack1)  (parts A,B,C,D of 4)
TP1  5017  [KS-5017]  (value not drawn)
U16  EFM32HG110F64G  [SI-QFN24]
U17  ASDMB  value 24MHz  [ABR-ASDMB]
U18  RTCMK  value 32.768kHz  [ABR-RTCMK]

### Ports
PWM, SCL, SDA

### Nets
3V3: L1.2
GND: C20.1 C21.1 C22.1 C23.1 C24.2 C25.1 C26.1 C27.1 C28.1 C29.2 C30.1 C31.1 P10.4 P10.6 P10.8 P10.10 P10.12 P10.14 P10.16 P10.18 P10.20 R35.2 R36.1 RN1.5 RN1.6 RN2.5 RN2.8 U16.25(VSS) U17.2(GND) U18.3(NC) U18.4(VSS)
VDDA: C25.2 C26.2 C27.2 R34.1 U16.9(AVDD_2) U16.12(AVDD_0)
VDDD: C20.2 C21.2 C22.2 C23.2 C24.1 C30.2 C31.2 P10.1 R32.2 R33.2 RN1.7 RN1.8 RN2.6 RN2.7 U16.2(IOVDD_0) U16.15(VDD_DREG) U16.22(IOVDD_5) U17.1(STBY) U17.4(VDD) U18.1(CLKOE) U18.8(VDD)
#RESET: C29.1 P10.15 RN2.2 U16.7(#RESET)
DBG_SWCLK: P10.7 RN1.2 U16.19(PF0)
DBG_SWDIO: P10.9 RN1.1 U16.20(PF1)
DBG_SWO: P10.13 RN2.3 U16.21(PF2)
HFXIN: U16.11(PB14) U17.3(OUT)
LFXIN: U16.6(PB8) U18.5(CLKOUT)
NetC28_2: C28.2 U16.16(DECOUPLE)
NetD7_1: D7.1(A) R33.1
NetD7_2: D7.2(K) U16.24(PE13)
NetL1_1: L1.1 R32.1 R34.2
NetP1_10: TP1.1 U16.1(PA0) ; port PWM
NetP9_3: U16.14(PD7) ; port SCL
NetP9_4: U16.13(PD6) ; port SDA
NetP10_2: P10.2 R36.2
NetP10_3: P10.3 RN1.4
NetP10_5: P10.5 RN1.3
NetP10_11: P10.11 RN2.4
NetP10_17: P10.17 RN2.1
NetP10_19: P10.19 R35.1

Not connected (* = marked no-connect by the designer): U16 3(PC0) 4(PC1) 5(PB7) 8(PB11) 10(PB13) 17(PC14) 18(PC15) 23(PE12); U18 2(#INT) 6(SCL) 7(SDA)

### Notes on the sheet
- (near P10) ARM SWD
- (in symbol PTP-KS-00001) TP

### Library data of the parts
C20 C27 = PC-TDK-02917: CAP CER 10UF 25V X7R 1206; Manufacturer Part Number: CGA5L1X7R1E106K160AC; Index: 2917; Tolerance: ±10%; Published: 3/16/2016; LatestRevisionDate: 3/16/2016; LatestRevisionNote: ...; PackageReference: 1206 (3216 Metric); Publisher: AlbertaSat; PackageDescription: Radial Cap, Thru-Hole; 2 Leads; 0.3 in Pin Spacing; Part Number: PC-TDK-02917; Supplier Part Number 1: 445-6990-1-ND; Supplier 1: Digi-key; Supplier Link: http://www.digikey.ca/product-search/en?keywords=445-6990-1-ND; Voltage - Rated: 25V; Temperature Coefficient: X7R; Applications: Automotive
C21-C24 C29 C31 = PC-TDK-02272: CAP CER 0.1UF 50V X8R 0603; Manufacturer Part Number: CGA3E3X8R1H104K080AB; Index: 2272; Tolerance: ±10%; Published: 3/16/2016; LatestRevisionDate: 3/16/2016; LatestRevisionNote: ...; PackageReference: 0603 (1608 Metric); Publisher: AlbertaSat; PackageDescription: Radial Cap, Thru-Hole; 2 Leads; 0.3 in Pin Spacing; Part Number: PC-TDK-02272; Supplier Part Number 1: 445-12606-1-ND; Supplier 1: Digi-key; Supplier Link: http://www.digikey.ca/product-search/en?keywords=445-12606-1-ND; Voltage - Rated: 50V; Temperature Coefficient: X8R; Applications: Automotive
C25 C26 C30 = PC-TDK-01883: CAP CER 10000PF 100V C0G 0603; Manufacturer Part Number: CGA3E1C0G2A103J080AC; Index: 1883; Designator: C?; Tolerance: ±5%; Temperature Coefficient: NP0; Published: 3/16/2016; LatestRevisionDate: 3/16/2016; LatestRevisionNote: ...; PackageReference: 0603 (1608 Metric); Publisher: AlbertaSat; PackageDescription: Radial Cap, Thru-Hole; 2 Leads; 0.3 in Pin Spacing; Part Number: PC-TDK-01883; Supplier Part Number 1: 445-172688-1-ND; Supplier 1: Digi-key; Supplier Link: http://www.digikey.ca/product-search/en?keywords=445-172688-1-ND; Voltage - Rated: 100V; Applications: Automotive
C28 = PC-TDK-02603: CAP CER 1UF 25V X7R 0603; Manufacturer Part Number: CGA3E1X7R1E105K080AC; Index: 2603; Designator: C?; Tolerance: ±10%; Published: 3/16/2016; LatestRevisionDate: 3/16/2016; LatestRevisionNote: ...; PackageReference: 0603 (1608 Metric); Publisher: AlbertaSat; PackageDescription: Radial Cap, Thru-Hole; 2 Leads; 0.3 in Pin Spacing; Part Number: PC-TDK-02603; Supplier Part Number 1: 445-6931-1-ND; Supplier 1: Digi-key; Supplier Link: http://www.digikey.ca/product-search/en?keywords=445-6931-1-ND; Voltage - Rated: 25V; Temperature Coefficient: X7R; Applications: Automotive
D7 = 4: LED BLUE CLEAR 0603 SMD; Part Number: 4; Manufacturer Part Number: 150060BS75000; Designator: D?; Brightness: 145mcd; Published: 8-Jun-2000; LatestRevisionDate: 08-Jul-2005; LatestRevisionNote: Mech Layer 1 removed.; PackageReference: WL-150060XS75000; Publisher: Altium Limited; PackageDescription: LED; 2 Leads; Supplier Part Number 1: 732-4966-1-ND; Supplier 1: Digi-Key; Supplier Link: http://www.digikey.ca/product-search/en?keywords=732-4966-1-ND
L1 = PL-TDK-02954: FERRITE BEAD 1 KOHM 0603 1LN; Manufacturer Part Number: MPZ1608S102ATD25; Code_IEC: 1608; Value: 1 kOhm @ 100MHz; Index: 2954; Designator: L?; Current - Rated: 800mA; Published: 7/8/2017; LatestRevisionDate: 7/8/2017; LatestRevisionNote: ...; PackageReference: 0603 (1608 Metric); Publisher: AlbertaSat; PackageDescription: Chip Inductor, 2-Leads, Body 1.60x0.80mm, IPC Low Density; Code_JEITA: 0603; Part Number: PL-TDK-02954; Supplier Part Number 1: 445-172890-1-ND; Supplier 1: Digi-key; Supplier Part Number 2: 810-MPZ1608S102ATD25; Supplier 2: Mouser; Supplier Link: #https://www.digikey.ca/product-detail/en/tdk-corporation/MPZ1608S102ATD25/445-172890-1-ND/5040521#; Applications: Automotive
P10 = PP-SLN-00022: CONN HEADER .050"" 20PS DL PCB AU; Manufacturer Part Number: GRPB102VWVN-RC; Index: 22; Designator: P?; Number of Positions: 20; LatestRevisionDate: 3/16/2016; LatestRevisionNote: ...; Publisher: AlbertaSat; Part Number: PP-SLN-00022; Supplier Part Number 1: S9015E-10-ND; Supplier 1: Digi-key; Published: 3/16/2016; PackageReference: SLN-GRPB102; PackageDescription: CONN HEADER .050"" 20PS DL PCB AU; Supplier Link: http://www.digikey.ca/product-search/en?keywords=S9015E-10-ND; Number of Rows: 2
R32 R34 = PR-VSH-00048: RES SMD 1 OHM 1% 1/8W 0603; Manufacturer Part Number: MCT06030C1008FP500; Index: 4; Designator: R?; Temperature Coefficient: ±50ppm/°C; Published: 3/14/2016; LatestRevisionDate: 3/14/2016; LatestRevisionNote: ...; PackageReference: 0603 (1608 Metric); Publisher: AlbertaSat; PackageDescription: Chip Resistor, 2-Leads, Body 1.55x0.85mm, IPC Low Density; Part Number: PR-VSH-00048; Supplier Part Number 1: MCT0603-1.00-CFCT-ND; Supplier 1: Digi-key; Supplier Link: http://www.digikey.ca/product-search/en?keywords=MCT0603-1.00-CFCT-ND; Tolerance: ±1%; Power - Rated: 1/8W; Applications: General Purpose
R33 R36 = 17203: as R28 on sheet multiplexers; Published: 8-Jun-2000; LatestRevisionDate: 29-May-2009; LatestRevisionNote: IPC-7351 Footprint Added.; PackageReference: 0603 (1608 Metric); Publisher: Altium Limited; PackageDescription: Chip Resistor, 2-Leads, Body 1.60x0.80mm, IPC Low Density; Supplier Part Number 1: P10.0KHCT-ND; Supplier 1: Digi-Key; Supplier Link: http://www.digikey.ca/product-search/en?keywords=P10.0KHCT-ND; Tolerance: ±1%
R35 = 15398: as R1 on sheet Connectors; Published: 8-Jun-2000; LatestRevisionDate: 29-May-2009; LatestRevisionNote: IPC-7351 Footprint Added.; PackageReference: 0603 (1608 Metric); Publisher: Altium Limited; PackageDescription: Chip Resistor, 2-Leads, Body 1.60x0.80mm, IPC Low Density; Supplier Part Number 1: P1.00KHCT-ND; Supplier 1: Digi-Key; Supplier Link: http://www.digikey.ca/product-search/en?keywords=P1.00KHCT-ND; Tolerance: ±1%
RN1 RN2 = 19830: RES ARRAY 4 RES 1K OHM 1206; Part Number: 19830; Manufacturer Part Number: EXB-38V102JV; Sim Note: Enter the Resistance value into parameter field.; Designator: RN?; Tolerance: ±5%; Power: 62.5mW; Temperature Coefficient: ±200ppm/°C; Code_JEDEC: MS-012-AC; Supplier Part Number 1: Y9102CT-ND; Supplier 1: Digi-Key; Supplier Link: http://www.digikey.ca/product-search/en?keywords=Y9102CT-ND; PackageReference: 1206 (3216 Metric), Convex, Long Side Terminals; PackageDescription: Chip Array, ConvexS, 8-Leads, Pitch 0.80mm,  Body 3.20x1.60mm,  IPC Low Density
TP1 = PTP-KS-00001: PC TEST POINT MINI SMD; Index: 1; Designator: TP?; Part Number: PTP-KS-00001; Manufacturer Part Number: 5017; Supplier Part Number 1: 36-5017CT-ND; Supplier 1: Digi-key; Publisher: AlbertaSat; Published: 3/15/2016; LatestRevisionDate: 3/15/2016; LatestRevisionNote: ...; PackageReference: KS-5017; PackageDescription: Testpoint Lug Mini SMD 27X10X152; Supplier Link: #http://www.digikey.ca/product-detail/en/keystone-electronics/5017/36-5017TR-ND/2217304#
U16 = PU-SI-00016: EFM32HG110F64G-B-QFN24; Index: 16; Designator: U?; Core Processor: ARM Cortex-M0+; Core Size: 32-Bit; Speed: 25MHz; Program Memory Size: 64KB (64K x 8); RAM Size: 8K x 8; Part Number: PU-SI-00016; Manufacturer Part Number: EFM32HG110F64G-B-QFN24; Supplier Part Number 1: 336-3848-ND; Supplier 1: Digi-key; Supplier Part Number 2: 634-HG110F64GBQFN24; Supplier 2: Mouser; Publisher: AlbertaSat; Published: 2018-05-01; LatestRevisionDate: 2018-05-01; LatestRevisionNote: ...; PackageReference: SI-QFN24; PackageDescription: QFN, 24-Leads, Body 5.00x5.00mm, Pitch 0.65mm/0.64mm, Thermal Pad 3.60x3.60mm, IPC Low Density; Supplier Link: #https://www.digikey.ca/product-detail/en/silicon-labs/EFM32HG110F64G-B-QFN24/336-3848-ND/6564870#; Applications: General Purpose; Operating Temperature: -40°C ~ 85°C (TA)
U17 = PU-ABR-00018: OSC MEMS 24.000MHZ CMOS SMD; Manufacturer Part Number: ASDMB-24.000MHZ-XY-T; Index: 18; Designator: U?; Tolerance: ±10ppm; Part Number: PU-ABR-00018; Supplier Part Number 1: 535-11155-1-ND; Supplier 1: Digi-key; Supplier Part Number 2: 815-ASDMB-24-XY-T; Supplier 2: Mouser; Publisher: AlbertaSat; Published: 2017-10-24; LatestRevisionDate: 2017-10-24; LatestRevisionNote: ...; PackageReference: 4-SMD, No Lead; PackageDescription: DFN, 4-Leads, Body 2.00x2.50mm, Pitch 1.65mm, IPC Low Density; Supplier Link: http://www.digikey.ca/product-search/en?keywords=535-11155-1-ND
U18 = PU-ABR-00037: IC RTC CLK/CALENDAR I2C 8-SMT; Manufacturer Part Number: AB-RTCMK-32.768KHZ-T3; Index: 37; Designator: U?; Part Number: PU-ABR-00037; Supplier Part Number 1: 535-11916-1-ND; Supplier 1: Digi-key; Supplier Part Number 2: 815-AB-RTCMK-32.7KT3; Supplier 2: Mouser; Publisher: AlbertaSat; Published: 4/23/2018; LatestRevisionDate: 4/23/2018; LatestRevisionNote: ...; PackageReference: 8-SMD Module; PackageDescription: 8-SMD Module; Supplier Link: https://www.digikey.ca/product-detail/en/abracon-llc/AB-RTCMK-32.768KHZ-T3/535-11916-1-ND/3601050

## Nets that join several sheets
3V3: multiplexers (32 pins), Connectors (18 pins), Slip_Ring (P9.1 P11.1 R30.2 R31.2), Current_Sensors (12 pins), PWM_Controller (L1.2)
GND: multiplexers (30 pins), Connectors (12 pins), Slip_Ring (P9.2 P11.2), Current_Sensors (8 pins), PWM_Controller (31 pins)
VA: Connectors (6 pins), Current_Sensors (R9.1 R11.1)
VB: Connectors (6 pins), Current_Sensors (R10.1 R12.1)
VC: Connectors (6 pins), Current_Sensors (R15.1 R17.1)
VD: Connectors (6 pins), Current_Sensors (R16.1 R18.1)
NetP1_1: multiplexers (U8.3), Connectors (P1.1)
NetP1_2: multiplexers (U7.3), Connectors (P1.2)
NetP1_5: multiplexers (U6.3), Connectors (P1.5)
NetP1_6: multiplexers (U5.3), Connectors (P1.6)
NetP1_10: Connectors (12 pins), PWM_Controller (TP1.1 U16.1)
NetP1_15: multiplexers (U10.3), Connectors (P1.15)
NetP1_16: multiplexers (U9.3), Connectors (P1.16)
NetP1_19: multiplexers (U12.3), Connectors (P1.19)
NetP1_20: multiplexers (U11.3), Connectors (P1.20)
NetP2_1: multiplexers (U8.15), Connectors (P2.1)
NetP2_2: multiplexers (U7.15), Connectors (P2.2)
NetP2_5: multiplexers (U6.15), Connectors (P2.5)
NetP2_6: multiplexers (U5.15), Connectors (P2.6)
NetP2_15: multiplexers (U10.15), Connectors (P2.15)
NetP2_16: multiplexers (U9.15), Connectors (P2.16)
NetP2_19: multiplexers (U12.15), Connectors (P2.19)
NetP2_20: multiplexers (U11.15), Connectors (P2.20)
NetP3_1: multiplexers (U8.2), Connectors (P3.1)
NetP3_2: multiplexers (U7.2), Connectors (P3.2)
NetP3_5: multiplexers (U6.2), Connectors (P3.5)
NetP3_6: multiplexers (U5.2), Connectors (P3.6)
NetP3_15: multiplexers (U10.2), Connectors (P3.15)
NetP3_16: multiplexers (U9.2), Connectors (P3.16)
NetP3_19: multiplexers (U12.2), Connectors (P3.19)
NetP3_20: multiplexers (U11.2), Connectors (P3.20)
NetP4_1: multiplexers (U8.14), Connectors (P4.1)
NetP4_2: multiplexers (U7.14), Connectors (P4.2)
NetP4_5: multiplexers (U6.14), Connectors (P4.5)
NetP4_6: multiplexers (U5.14), Connectors (P4.6)
NetP4_15: multiplexers (U10.14), Connectors (P4.15)
NetP4_16: multiplexers (U9.14), Connectors (P4.16)
NetP4_19: multiplexers (U12.14), Connectors (P4.19)
NetP4_20: multiplexers (U11.14), Connectors (P4.20)
NetP5_1: multiplexers (U8.1), Connectors (P5.1)
NetP5_2: multiplexers (U7.1), Connectors (P5.2)
NetP5_5: multiplexers (U6.1), Connectors (P5.5)
NetP5_6: multiplexers (U5.1), Connectors (P5.6)
NetP5_15: multiplexers (U10.1), Connectors (P5.15)
NetP5_16: multiplexers (U9.1), Connectors (P5.16)
NetP5_19: multiplexers (U12.1), Connectors (P5.19)
NetP5_20: multiplexers (U11.1), Connectors (P5.20)
NetP6_1: multiplexers (U8.13), Connectors (P6.1)
NetP6_2: multiplexers (U7.13), Connectors (P6.2)
NetP6_5: multiplexers (U6.13), Connectors (P6.5)
NetP6_6: multiplexers (U5.13), Connectors (P6.6)
NetP6_15: multiplexers (U10.13), Connectors (P6.15)
NetP6_16: multiplexers (U9.13), Connectors (P6.16)
NetP6_19: multiplexers (U12.13), Connectors (P6.19)
NetP6_20: multiplexers (U11.13), Connectors (P6.20)
NetP7_1: multiplexers (U8.5), Slip_Ring (P7.1)
NetP7_2: multiplexers (U7.5), Slip_Ring (P7.2)
NetP7_3: multiplexers (U6.5), Slip_Ring (P7.3)
NetP7_4: multiplexers (U5.5), Slip_Ring (P7.4)
NetP8_1: multiplexers (U9.5), Slip_Ring (P8.1)
NetP8_2: multiplexers (U10.5), Slip_Ring (P8.2)
NetP8_3: multiplexers (U11.5), Slip_Ring (P8.3)
NetP8_4: multiplexers (U12.5), Slip_Ring (P8.4)
NetP9_3: multiplexers (U14.14), Slip_Ring (P9.3 R30.1), Current_Sensors (8 pins), PWM_Controller (U16.14)
NetP9_4: multiplexers (U14.15), Slip_Ring (P9.4 R31.1), Current_Sensors (8 pins), PWM_Controller (U16.13)
NetQ1_2: multiplexers (U13.14), Connectors (Q1.2 R19.2)
NetQ2_2: multiplexers (U13.11), Connectors (Q2.2 R20.2)
NetQ3_2: multiplexers (U13.13), Connectors (Q3.2 R21.2)
NetQ4_2: multiplexers (RN3.1 U7.7 U8.7 U14.7), Current_Sensors (Q4.2)
NetQ5_2: multiplexers (RN4.4 U5.7 U6.7 U14.9), Current_Sensors (Q5.2)
NetQ6_2: multiplexers (RN4.3 U9.7 U10.7 U14.10), Current_Sensors (Q6.2)
NetQ7_2: multiplexers (RN4.2 U11.7 U12.7 U14.11), Current_Sensors (Q7.2)
NetQ8_2: multiplexers (U13.10), Connectors (Q8.2 R22.2)
NetQ9_2: multiplexers (U13.12), Connectors (Q9.2 R23.2)
NetQ10_2: multiplexers (U13.9), Connectors (Q10.2 R24.2)